# Altium schematic sheet Power.SchDoc
size A4; PageSetup: Record=PageOptions|CenterHorizontal=True|CenterVertical=True|PrintScale=0.98|XCorrection=1.00|YCorrection=1.00|PrintKind=0|BorderSize=5000000|LeftOffset=0|BottomOffset=0|Orientation=2|PaperLength=1000|PaperWidth=1000|Scale=100|PaperSource=7|PrintQuality=-4|MediaType=1|DitherType=10|PaperKind=A4|PrintScaleMode=1
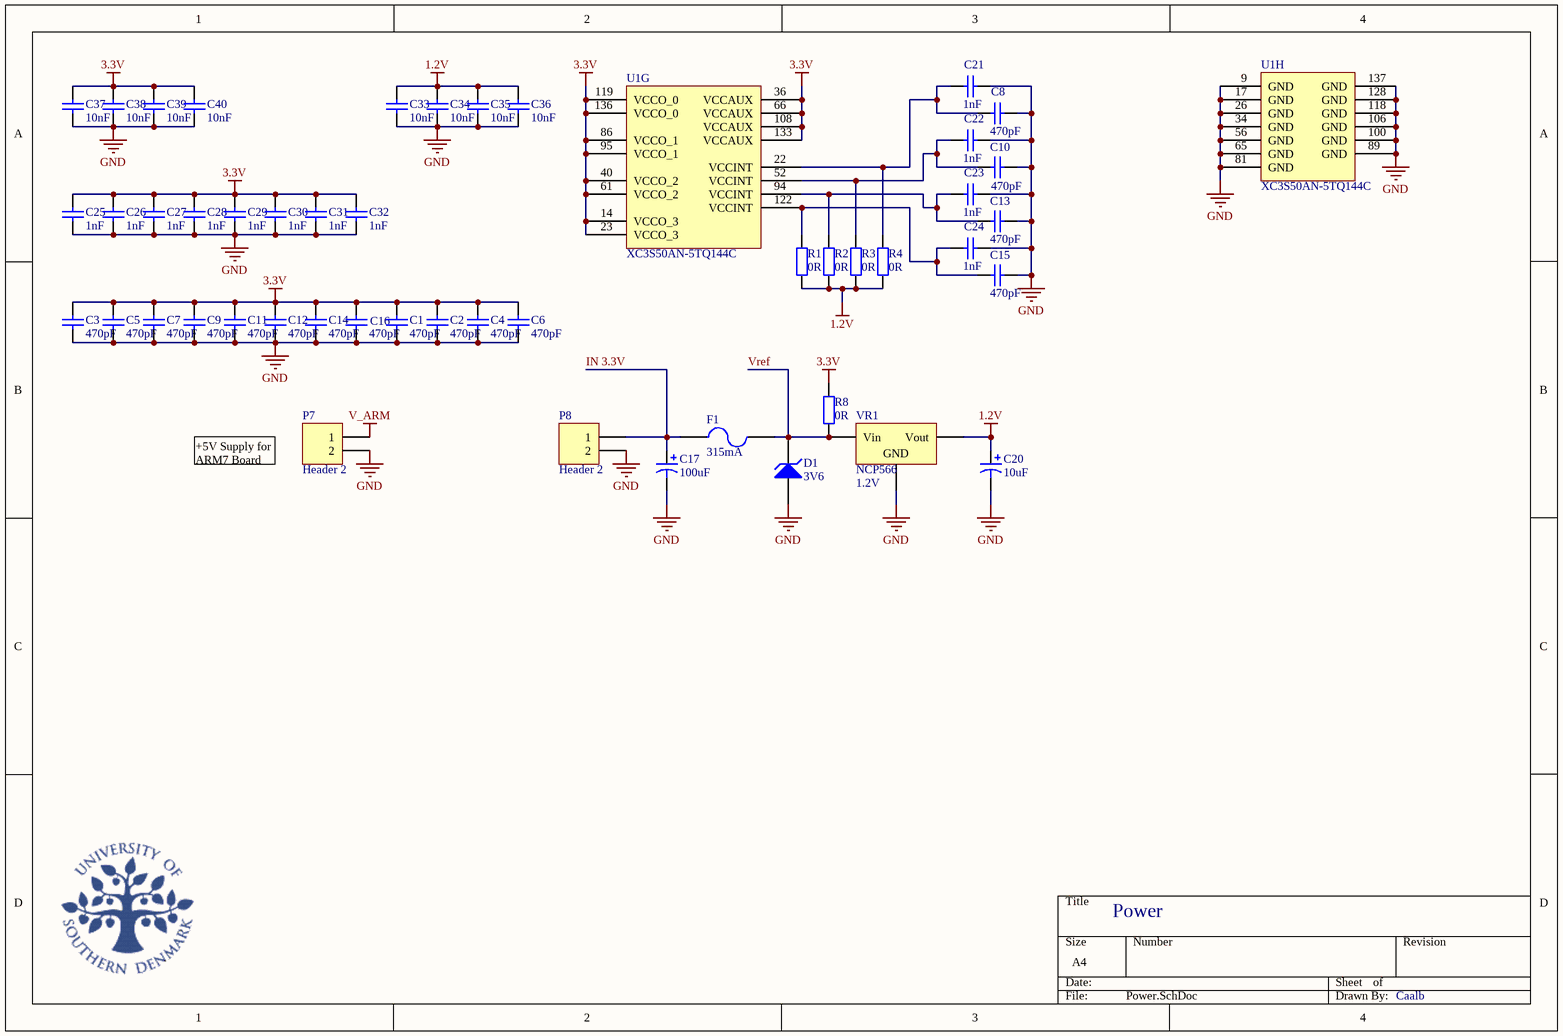
[diagram p0: Power.SchDoc]

## Parts
C1  value 470pF  [0603]  (hidden comment: Cap)
C2  value 470pF  [0603]  (hidden comment: Cap)
C3  value 470pF  [0603]  (hidden comment: Cap)
C4  value 470pF  [0603]  (hidden comment: Cap)
C5  value 470pF  [0603]  (hidden comment: Cap)
C6  value 470pF  [0603]  (hidden comment: Cap)
C7  value 470pF  [0603]  (hidden comment: Cap)
C8  value 470pF  [0603]  (hidden comment: Cap)
C9  value 470pF  [0603]  (hidden comment: Cap)
C10  value 470pF  [0603]  (hidden comment: Cap)
C11  value 470pF  [0603]  (hidden comment: Cap)
C12  value 470pF  [0603]  (hidden comment: Cap)
C13  value 470pF  [0603]  (hidden comment: Cap)
C14  value 470pF  [0603]  (hidden comment: Cap)
C15  value 470pF  [0603]  (hidden comment: Cap)
C16  value 470pF  [0603]  (hidden comment: Cap)
C17  value 100uF  [Tantal 100uF 10V (lager)]  (hidden comment: Cap Pol1)
C20  value 10uF  [1206Pol]  (hidden comment: Cap Pol1)
C21  value 1nF  [0603]  (hidden comment: Cap)
C22  value 1nF  [0603]  (hidden comment: Cap)
C23  value 1nF  [0603]  (hidden comment: Cap)
C24  value 1nF  [0603]  (hidden comment: Cap)
C25  value 1nF  [0603]  (hidden comment: Cap)
C26  value 1nF  [0603]  (hidden comment: Cap)
C27  value 1nF  [0603]  (hidden comment: Cap)
C28  value 1nF  [0603]  (hidden comment: Cap)
C29  value 1nF  [0603]  (hidden comment: Cap)
C30  value 1nF  [0603]  (hidden comment: Cap)
C31  value 1nF  [0603]  (hidden comment: Cap)
C32  value 1nF  [0603]  (hidden comment: Cap)
C33  value 10nF  [0603]  (hidden comment: Cap)
C34  value 10nF  [0603]  (hidden comment: Cap)
C35  value 10nF  [0603]  (hidden comment: Cap)
C36  value 10nF  [0603]  (hidden comment: Cap)
C37  value 10nF  [1206]  (hidden comment: Cap)
C38  value 10nF  [1206]  (hidden comment: Cap)
C39  value 10nF  [1206]  (hidden comment: Cap)
C40  value 10nF  [1206]  (hidden comment: Cap)
D1  3V6  [d1206]
F1  315mA  [1206]
P7  Header 2  [HDR2x1 M LÅS]
P8  Header 2  [HDR2x1 M LÅS]
R1  value 0R  [J0805]  (hidden comment: Res2)
R2  value 0R  [J0805]  (hidden comment: Res2)
R3  value 0R  [J0805]  (hidden comment: Res2)
R4  value 0R  [J0805]  (hidden comment: Res2)
R8  value 0R  [J0805]  (hidden comment: Res2)
U1  XC3S50AN-5TQ144C  [TQ144_L]  (parts G,H of 8)
VR1  NCP566  value 1.2V  [SOT-223]

## Nets
1.2V: C20.1 C33.2 C34.2 C35.2 C36.2 R1.1 R2.1 R3.1 R4.1 VR1.3(Vout)
3.3V: C1.1 C2.1 C3.2 C4.1 C5.2 C6.1 C7.2 C9.2 C11.2 C12.2 C14.2 C16.2 C25.2 C26.2 C27.2 C28.2 C29.2 C30.2 C31.2 C32.2 C37.2 C38.2 C39.2 C40.2 R8.1 U1.14(VCCO_3) U1.23(VCCO_3) U1.36(VCCAUX) U1.40(VCCO_2) U1.61(VCCO_2) U1.66(VCCAUX) U1.86(VCCO_1) U1.95(VCCO_1) U1.108(VCCAUX) U1.119(VCCO_0) U1.133(VCCAUX) U1.136(VCCO_0)
GND: C1.2 C2.2 C3.1 C4.2 C5.1 C6.2 C7.1 C8.2 C9.1 C10.2 C11.1 C12.1 C13.2 C14.1 C15.2 C16.1 C17.2 C20.2 C21.2 C22.2 C23.2 C24.2 C25.1 C26.1 C27.1 C28.1 C29.1 C30.1 C31.1 C32.1 C33.1 C34.1 C35.1 C36.1 C37.1 C38.1 C39.1 C40.1 D1.1(A) P7.2 P8.2 U1.9(GND) U1.17(GND) U1.26(GND) U1.34(GND) U1.56(GND) U1.65(GND) U1.81(GND) U1.89(GND) U1.100(GND) U1.106(GND) U1.118(GND) U1.128(GND) U1.137(GND) VR1.2(GND)
V_ARM: P7.1
IN 3.3V: C17.1 F1.1 P8.1
Vref: D1.2(K) F1.2 R8.2 VR1.1(Vin)
NetC8_1: C8.1 C21.1 R4.2 U1.22(VCCINT)
NetC10_1: C10.1 C22.1 R3.2 U1.52(VCCINT)
NetC13_1: C13.1 C23.1 R2.2 U1.94(VCCINT)
NetC15_1: C15.1 C24.1 R1.2 U1.122(VCCINT)

## Notes on the sheet
- +5V Supply for ARM7 Board
- Power
- Caalb

## Library data of the parts
C1-C16 C21-C40 = Cap: !Capacitor; Published: 8-Jun-2000; LatestRevisionDate: 17-Jul-2002; LatestRevisionNote: Re-released for DXP Platform.; PackageReference: RAD-0.3; Publisher: Altium Limited
C17 C20 = Cap Pol1: !Polarized Capacitor (Radial); Published: 8-Jun-2000; LatestRevisionDate: 17-Jul-2002; LatestRevisionNote: Re-released for DXP Platform.; PackageReference: RB7.6-15; Publisher: Altium Limited
D1 = D Zener: Zener Diode; Value: 3.5V; Published: 8-Jun-2000; LatestRevisionDate: 17-Jul-2002; LatestRevisionNote: Re-released for DXP Platform.; PackageReference: DIODE-0.7; Publisher: Altium Limited
F1 = Fuse 2: Fuse; Published: 8-Jun-2000; LatestRevisionDate: 17-Jul-2002; LatestRevisionNote: Re-released for DXP Platform.; PackageReference: PIN-W2/E2.8; Publisher: Altium Limited
P7 P8 = Header 2: Header, 2-Pin M LÅS; LatestRevisionDate: 17-Jul-2002; LatestRevisionNote: Re-released for DXP Platform.; Publisher: Altium Limited
R1-R4 R8 = Res2: !Resistor; Published: 8-Jun-2000; LatestRevisionDate: 17-Jul-2002; LatestRevisionNote: Re-released for DXP Platform.; PackageReference: AXIAL-0.4; Publisher: Altium Limited
U1 = XC3S50AN-5TQ144C: Spartan-3AN Non-Volatile FPGA, 108 User I/Os, 144-Pin TQFP, High Performance, Commercial Grade; Published: 20-Jul-2007; DatasheetVersion: 26-Feb-2007; PackageVersion: ver1.2, Jun-2004; PackageReference: TQ144; Publisher: Altium Limited; PackageDescription: 144-Pin Thin Quad Flat Pack (TQ144); Code_JEDEC: MS-026-BFB; ComponentLink1Description: Manufacturer Link; ComponentLink1URL: http://www.xilinx.com/products/silicon_solutions/fpgas/spartan_series/spartan3an_fpgas/index.htm; ComponentLink2Description: Datasheet; ComponentLink2URL: http://direct.xilinx.com/bvdocs/publications/ds557.pdf
VR1 = Volt Reg: Volt Reg NCP566; Published: 24-Mar-1999; LatestRevisionDate: 17-Jul-2002; LatestRevisionNote: Re-released for DXP Platform.; PackageReference: D2PAK; Publisher: Altium Limited; Code_JEDEC: SMD-220